# Altium schematic sheet USB-C - UART Serial Bridge.SchDoc
size A4; SheetNumber: 2; SheetTotal: 5
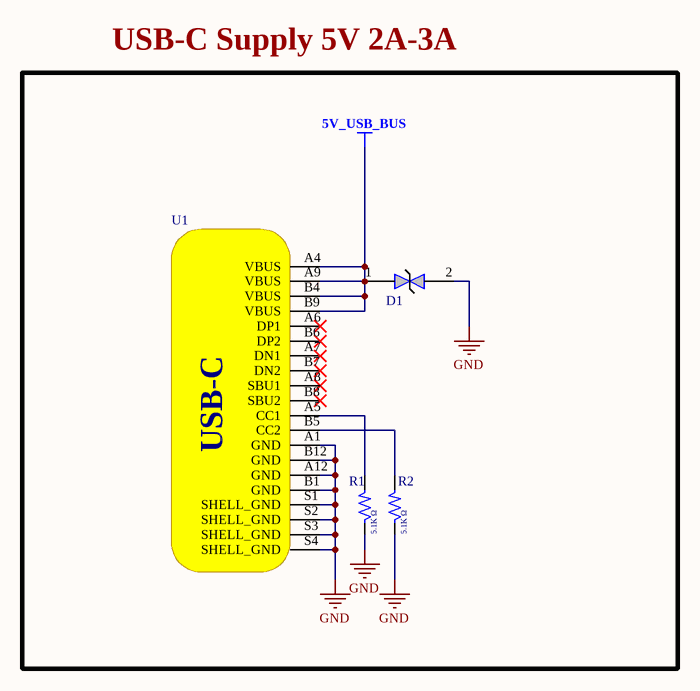
[diagram p0: USB-C - UART Serial Bridge.SchDoc]

## Parts
D1  PESD3V3L1BA,  [Nexperia_SOD323_0]  (value not drawn)
R1  5.1K Ω  [RES_0603]
R2  5.1K Ω  [RES_0603]
U1  C393939  [USB-C 16Pin]  (value not drawn)

## Blocks framed on the sheet
USB-C Supply 5V 2A-3A: D1 R1 R2 U1

## Nets
5V_USB_BUS: D1.1 U1.A4(VBUS) U1.A9(VBUS) U1.B4(VBUS) U1.B9(VBUS)
GND: D1.2 R1.1 R2.1 U1.A1(GND) U1.A12(GND) U1.B1(GND) U1.B12(GND) U1.S1(SHELL_GND) U1.S2(SHELL_GND) U1.S3(SHELL_GND) U1.S4(SHELL_GND)
NetR1_2: R1.2 U1.A5(CC1)
NetR2_2: R2.2 U1.B5(CC2)

Not connected (* = marked no-connect by the designer): U1 A6(DP1)* A7(DN1)* A8(SBU1)* B6(DP2)* B7(DN2)* B8(SBU2)*

## Notes on the sheet
- (in symbol USB-C 16Pin) USB-C

## Library data of the parts
D1 = DIO_TVS_PESD3V3L1BA,115
R1 R2 = RES_82K-0.1W-1%-0603: 82 kOhms ±1% 0.125W, 1/8W Chip Resistor 0603 (1608 Metric) Anti-Sulfur Thin Film; Manufacturer: Vishay Beyschlag; Manufacturer Part Number: MCT06030C8202FP500; Alternate Part Number-1: NA; Case/Package: 0603; Supplier-1: SIRICOM; Supplier Part Number-1: NA
U1 = USB-C 16Pin: USB-C (USB TYPE-C) Receptacle Connector 16 Position Surface Mount, Right Angle; Manufacturer: SHOU HAN; Manufacturer PN: N/A; Supplier  PN: C393939; Supplier: LCSC